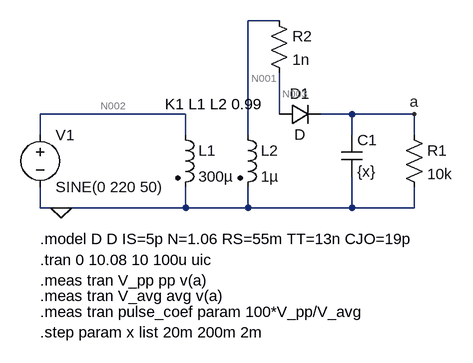
[diagram p0: schematic 1.6.asc]
1.6.asc, the LTspice schematic file:
Version 4
SHEET 1 880 680
WIRE 464 -64 416 -64
WIRE 320 80 96 80
WIRE 464 80 464 16
WIRE 576 80 528 80
WIRE 672 80 576 80
WIRE 96 112 96 80
WIRE 320 112 320 80
WIRE 416 112 416 -64
WIRE 576 112 576 80
WIRE 672 112 672 80
WIRE 96 224 96 192
WIRE 128 224 96 224
WIRE 320 224 320 192
WIRE 320 224 128 224
WIRE 416 224 416 192
WIRE 416 224 320 224
WIRE 576 224 576 176
WIRE 576 224 416 224
WIRE 672 224 672 192
WIRE 672 224 576 224
FLAG 128 224 0
FLAG 672 80 a
SYMBOL voltage 96 96 R0
WINDOW 123 0 0 Left 0
WINDOW 39 0 0 Left 0
SYMATTR InstName V1
SYMATTR Value SINE(0 220 50)
SYMBOL ind2 304 96 R0
SYMATTR InstName L1
SYMATTR Value 300µ
SYMATTR SpiceLine Rser=10m
SYMATTR Type ind
SYMBOL ind2 400 96 R0
SYMATTR InstName L2
SYMATTR Value 1µ
SYMATTR SpiceLine Rser=10m
SYMATTR Type ind
SYMBOL diode 464 96 R270
WINDOW 0 32 32 VTop 2
WINDOW 3 0 32 VBottom 2
SYMATTR InstName D1
SYMBOL cap 560 112 R0
SYMATTR InstName C1
SYMATTR Value {x}
SYMBOL res 656 96 R0
SYMATTR InstName R1
SYMATTR Value 10k
SYMBOL res 448 -80 R0
SYMATTR InstName R2
SYMATTR Value 1n
TEXT 96 272 Left 2 !.model D D IS=5p N=1.06 RS=55m TT=13n CJO=19p
TEXT 96 304 Left 2 !.tran 0 10.08 10 100u uic
TEXT 96 336 Left 2 !.meas tran V_pp pp v(a)
TEXT 96 360 Left 2 !.meas tran V_avg avg v(a)
TEXT 96 384 Left 2 !.meas tran pulse_coef param 100*V_pp/V_avg
TEXT 288 64 Left 2 !K1 L1 L2 0.99
TEXT 96 416 Left 2 !.step param x list 20m 200m 2m

The netlist it stands for:
* 1.6.asc
V1 N002 0 SINE(0 220 50)
L1 N002 0 300µ Rser=10m
L2 N001 0 1µ Rser=10m
D1 N003 a D
C1 a 0 {x}
R1 a 0 10k
R2 N001 N003 1n
.model D D
.lib standard.dio
.model D D IS=5p N=1.06 RS=55m TT=13n CJO=19p
.tran 0 10.08 10 100u uic
.meas tran V_pp pp v(a)
.meas tran V_avg avg v(a)
.meas tran pulse_coef param 100*V_pp/V_avg
K1 L1 L2 0.99
.step param x list 20m 200m 2m
.backanno
.end

* Results of the author's LTspice run, read from the files saved beside the schematic
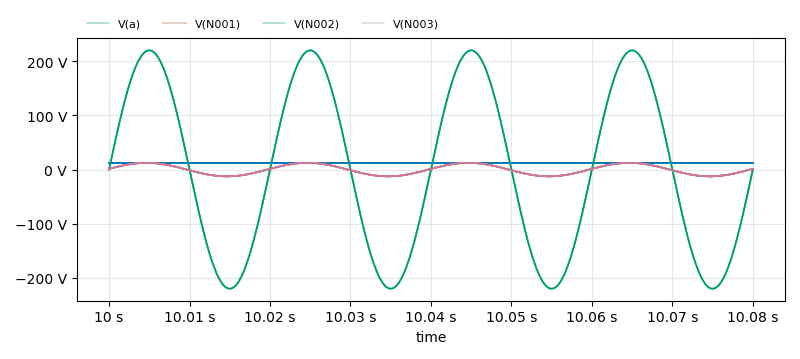
[diagram p1: Transient Analysis of 1.6.asc, plotted from the saved traces]
* Transient Analysis, 3 runs:
*   V(a) [x=0.002]: min 11.86 V, max 11.87 V, average 11.86 V, rms 11.86 V, last 11.86 V
*   V(a) [x=0.02]: min 11.86 V, max 11.86 V, average 11.86 V, rms 11.86 V, last 11.86 V
*   V(a) [x=0.2]: min 11.86 V, max 11.86 V, average 11.86 V, rms 11.86 V, last 11.86 V
*   V(N001) [x=0.002]: min -12.5 V, max 12.5 V, average 3.425 mV, rms 8.839 V, last 1.319 V
*   V(N001) [x=0.02]: min -12.5 V, max 12.5 V, average 3.521 mV, rms 8.839 V, last 1.319 V
*   V(N001) [x=0.2]: min -12.5 V, max 12.5 V, average 3.385 mV, rms 8.839 V, last 1.319 V
*   V(N002) [x=0.002]: min -220 V, max 220 V, average 58.56 mV, rms 155.5 V, last 0 V
*   V(N002) [x=0.02]: min -220 V, max 220 V, average 60.11 mV, rms 155.5 V, last 0 V
*   V(N002) [x=0.2]: min -220 V, max 220 V, average 57.75 mV, rms 155.5 V, last 0 V
*   V(N003) [x=0.002]: min -12.5 V, max 12.5 V, average 3.425 mV, rms 8.839 V, last 1.319 V
*   V(N003) [x=0.02]: min -12.5 V, max 12.5 V, average 3.521 mV, rms 8.839 V, last 1.319 V
*   V(N003) [x=0.2]: min -12.5 V, max 12.5 V, average 3.385 mV, rms 8.839 V, last 1.319 V
* From the log:
*   Measurement: v_pp
*     step  PP(v(a))  FROM  TO
*        1  0.0113029  0  0.08
*        2  0.00112915  0  0.08
*        3  0.000238419  0  0.08
*   Measurement: v_avg
*     step  AVG(v(a))  FROM  TO
*        1  11.8635  0  0.08
*        2  11.8637  0  0.08
*        3  11.8565  0  0.08
*   Measurement: pulse_coef
*     step  100*v_pp/v_avg
*        1  0.0952752
*        2  0.00951772
*        3  0.00201087